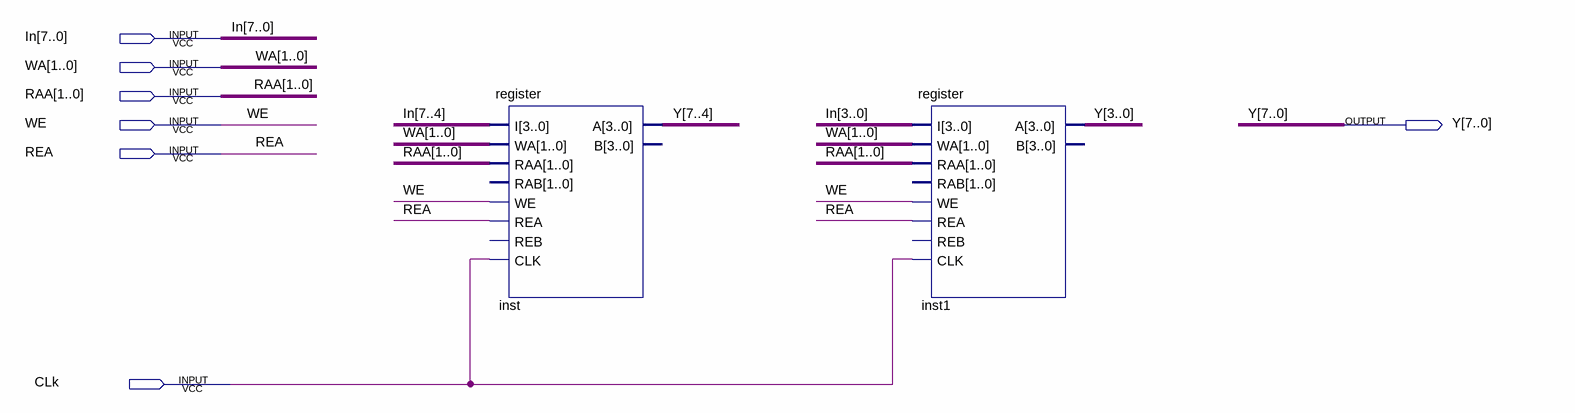
[diagram p0: schematic sheet]
// Quartus schematic Register4x8.bdf as structural Verilog: 2 symbols, 7 pins
module Register4x8 (
  input  [7:0] In,
  input  [1:0] WA,
  input  [1:0] RAA,
  input  WE,
  input  REA,
  input  CLk,
  output [7:0] Y
);

  register inst (.I(In[7:4]), .WA(WA), .RAA(RAA), .WE(WE), .REA(REA), .CLK(CLk), .A(Y[7:4]));  // open: RAB, REB, B
  register inst1 (.I(In[3:0]), .WA(WA), .RAA(RAA), .WE(WE), .REA(REA), .CLK(CLk), .A(Y[3:0]));  // open: RAB, REB, B
endmodule
